# EasyEDA Pro project CH32X033SimpleBoard_SCH.epro

# Schematic PCB1_SCH
Board Name: PCB1; Create Date: 2024-09-25; Page Name: CH32V003EasyUSBBoard_SCH; Project Name: CH32X033F8P6-DEV-1; Schematic Name: PCB1_SCH; Update Date: 2024-09-25
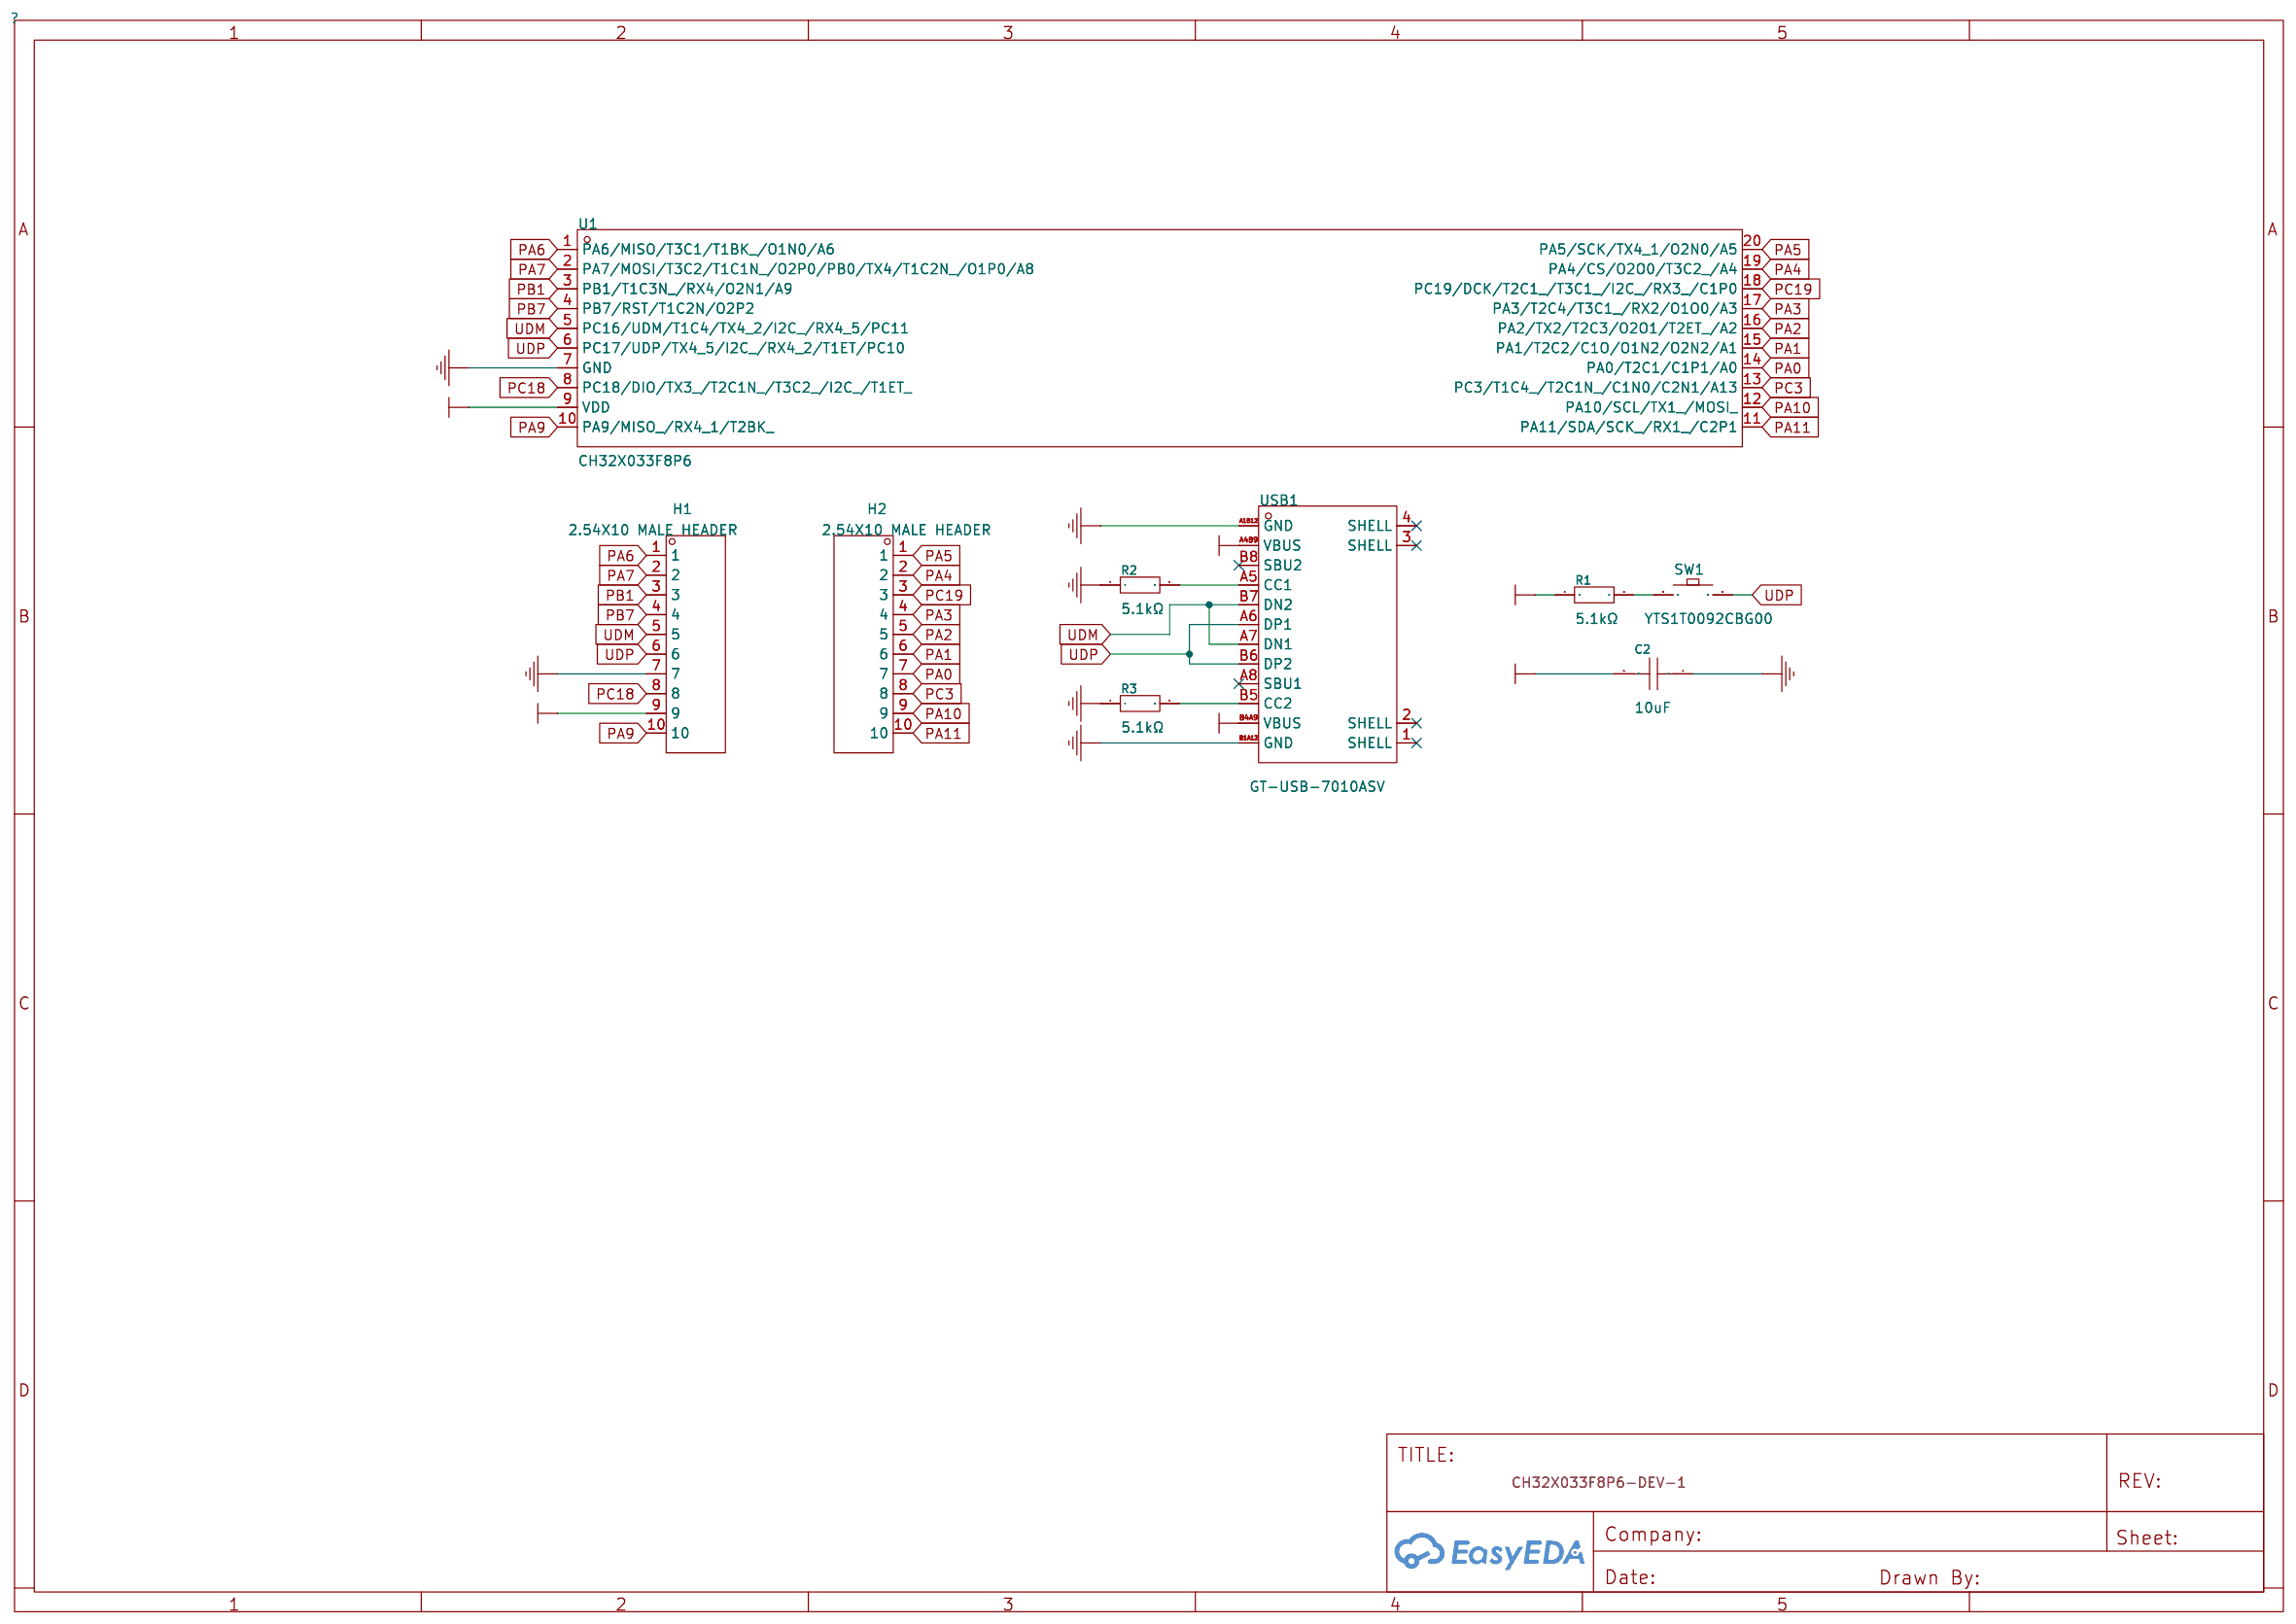
[diagram p0: schematic sheet]

## Parts
C2  10uF  [C0603]
H1  2.54X10 MALE HEADER  [footprint_8cc6]
H2  2.54X10 MALE HEADER  [footprint_8cc6]
R1  5.1kΩ  [R0603]
R2  5.1kΩ  [R0603]
R3  5.1kΩ  [R0603]
SW1  YTS1T0092CBG00  [SW-SMD_L4.0-W2.9-LS5.0]
U1  CH32X033F8P6  [TSSOP-20_L6.5-W4.4-P0.65-LS6.4-BL]
USB1  GT-USB-7010ASV  [USB-C-SMD_G-SWITCH_GT-USB-7010ASV]

## Library data of the parts
C2 = CL10A106KP8NNNC: Capacitance: Tolerance:±10% Tolerance:±10% Voltage Rated: Temperature Coefficient:; LCSC Part Name: 10uF ±10% 10V; Supplier Part: C19702; Manufacturer: SAMSUNG(三星); Supplier Footprint: 0603; JLCPCB Part Class: Basic Part; Datasheet: https://atta.szlcsc.com/upload/public/pdf/source/20160218/1457707763339.pdf; Supplier: LCSC; Tolerance: ±10%
H1 H2 = 2.54X10 MALE HEADER: Supplier: LCSC; Manufacturer: Ckmtw; Manufacturer Part: 210S-1*11P L=11.6MMGold-plated black; Supplier Part: C124372
R1-R3 = 0603WAF5101T5E: Type:Thick Film Resistors Resistance:5.1kΩ Tolerance:±1% Tolerance:±1% Power(Watts): Overload Voltage (Max): Temperature Coefficient:±100ppm/℃ Temperature Coefficient:±100ppm/℃ Operating Temperature Range:-55℃~+155℃ Operating Temperature Range:-55℃~+155℃; LCSC Part Name: 5.1kΩ ±1% 100mW 厚膜电阻; Supplier Part: C23186; Manufacturer: UNI-ROYAL(厚声); Supplier Footprint: 0603; JLCPCB Part Class: Basic Part; Datasheet: https://atta.szlcsc.com/upload/public/pdf/source/20200306/C422600_1E6D84923E4A46A82E41ADD87F860B5C.pdf; Supplier: LCSC; Type: Thick Film Resistors; Tolerance: ±1%; Temperature Coefficient: ±100ppm/℃; Operating Temperature Range: -55℃~+155℃
SW1 = BOOT: Supplier: LCSC; Supplier Part: C5221275; Manufacturer: YIYUAN(怡远)
U1 = CH32X033F8P6: Supplier Part: C19268290; Manufacturer: WCH(南京沁恒); Supplier Footprint: TSSOP-20; JLCPCB Part Class: Extended Part; Datasheet: https://atta.szlcsc.com/upload/public/pdf/source/20240813/D2D40F76D90A279166E8552BB723F188.pdf; Supplier: LCSC
USB1 = GT-USB-7010ASV: Connector Type:Type-C Standard:USB 2.0 Gender:Female Number of Ports:1 Number of Contacts:16P Mounting Style:卧贴 Current Rating - Power (Max):3A Contact Material:高导铜 Contact Plating:Gold Operating Temperature Range:-40℃~+85℃ Operating Temperature Range:-40; LCSC Part Name: Type-C 母 卧贴; Supplier Part: C2988369; Manufacturer: G-Switch(品赞); Supplier Footprint: SMD; JLCPCB Part Class: Extended Part; Datasheet: https://atta.szlcsc.com/upload/public/pdf/source/20230327/DF227B64686AC8FA0AD1775797F2C3F1.pdf; Supplier: LCSC; Connector Type: Type-C; Standard: USB 2.0; Gender: Female; Number of Ports: 1; Number of Contacts: 16P; Mounting Style: 卧贴; Current Rating - Power (Max): 3A; Contact Material: 高导铜; Contact Plating: Gold; Operating Temperature Range: -40℃~+85℃; Soldering Temperature(Max): 260℃

## Nets
+5V: C2.2 H1.9 R1.1 U1.9(VDD) USB1.A4B9(VBUS) USB1.B4A9(VBUS)
GND: C2.1 H1.7 R2.1 R3.1 U1.7(GND) USB1.A1B12(GND) USB1.B1A12(GND)
PA0: H2.7 U1.14(PA0/T2C1/C1P1/A0)
PA1: H2.6 U1.15(PA1/T2C2/C1O/O1N2/O2N2/A1)
PA2: H2.5 U1.16(PA2/TX2/T2C3/O2O1/T2ET_/A2)
PA3: H2.4 U1.17(PA3/T2C4/T3C1_/RX2/O1O0/A3)
PA4: H2.2 U1.19(PA4/CS/O2O0/T3C2_/A4)
PA5: H2.1 U1.20(PA5/SCK/TX4_1/O2N0/A5)
PA6: H1.1 U1.1(PA6/MISO/T3C1/T1BK_/O1N0/A6)
PA7: H1.2 U1.2(PA7/MOSI/T3C2/T1C1N_/O2P0/PB0/TX4/T1C2N_/O1P0/A8)
PA9: H1.10 U1.10(PA9/MISO_/RX4_1/T2BK_)
PA10: H2.9 U1.12(PA10/SCL/TX1_/MOSI_)
PA11: H2.10 U1.11(PA11/SDA/SCK_/RX1_/C2P1)
PB1: H1.3 U1.3(PB1/T1C3N_/RX4/O2N1/A9)
PB7: H1.4 U1.4(PB7/RST/T1C2N/O2P2)
PC3: H2.8 U1.13(PC3/T1C4_/T2C1N_/C1N0/C2N1/A13)
PC18: H1.8 U1.8(PC18/DIO/TX3_/T2C1N_/T3C2_/I2C_/T1ET_)
PC19: H2.3 U1.18(PC19/DCK/T2C1_/T3C1_/I2C_/RX3_/C1P0)
UDM: H1.5 U1.5(PC16/UDM/T1C4/TX4_2/I2C_/RX4_5/PC11) USB1.A7(DN1) USB1.B7(DN2)
UDP: H1.6 SW1.1 U1.6(PC17/UDP/TX4_5/I2C_/RX4_2/T1ET/PC10) USB1.A6(DP1) USB1.B6(DP2)
Net-(R1-2): R1.2 SW1.2
Net-(R2-2): R2.2 USB1.A5(CC1)
Net-(R3-2): R3.2 USB1.B5(CC2)

Not connected (* = marked no-connect by the designer): USB1 1(SHELL)* 2(SHELL)* 3(SHELL)* 4(SHELL)* A8(SBU1)* B8(SBU2)*
